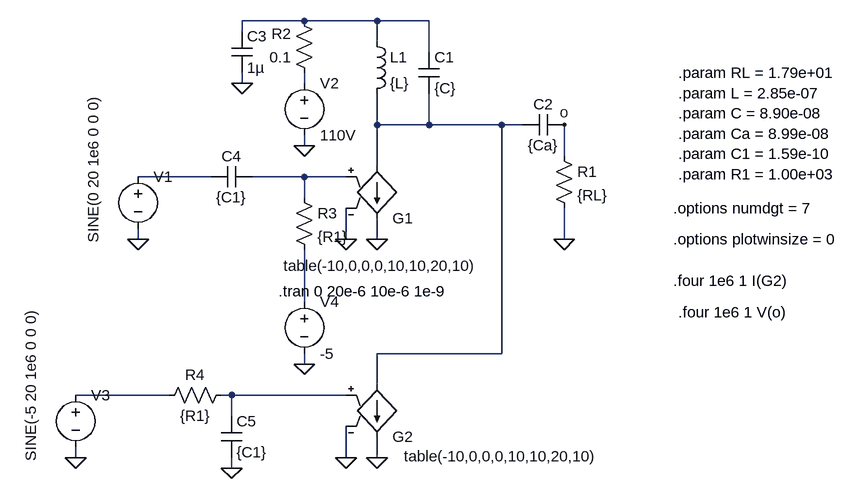
[diagram p0: schematic Parcial_20221128.asc]
Parcial_20221128.asc, the LTspice schematic file:
Version 4
SHEET 1 880 788
WIRE -288 -96 -384 -96
WIRE -176 -96 -288 -96
WIRE -96 -96 -176 -96
WIRE -384 -80 -384 -96
WIRE -176 -64 -176 -96
WIRE -96 -48 -96 -96
WIRE -384 0 -384 -16
WIRE -288 0 -288 -16
WIRE -176 64 -176 16
WIRE -96 64 -96 16
WIRE -96 64 -176 64
WIRE 16 64 -96 64
WIRE 48 64 16 64
WIRE -288 96 -288 80
WIRE 112 112 112 64
WIRE -176 128 -176 64
WIRE -432 144 -544 144
WIRE -288 144 -368 144
WIRE -224 144 -288 144
WIRE -288 176 -288 144
WIRE -544 240 -544 224
WIRE -224 240 -224 192
WIRE -176 240 -176 208
WIRE 112 240 112 192
WIRE -288 336 -288 256
WIRE 16 416 16 64
WIRE 16 416 -176 416
WIRE -288 432 -288 416
WIRE -176 464 -176 416
WIRE -496 480 -640 480
WIRE -400 480 -416 480
WIRE -224 480 -400 480
WIRE -400 512 -400 480
WIRE -640 576 -640 560
WIRE -224 576 -224 528
WIRE -176 576 -176 544
WIRE -400 592 -400 576
FLAG -176 240 0
FLAG 112 240 0
FLAG -224 240 0
FLAG -544 240 0
FLAG -288 96 0
FLAG 112 64 o
FLAG -384 0 0
FLAG -176 576 0
FLAG -224 576 0
FLAG -640 576 0
FLAG -288 432 0
FLAG -400 592 0
SYMBOL voltage -544 128 R0
WINDOW 3 -69 118 VLeft 2
WINDOW 123 0 0 Left 2
WINDOW 39 0 0 Left 2
SYMATTR Value SINE(0 20 1e6 0 0 0)
SYMATTR InstName V1
SYMBOL ind -192 -80 R0
SYMATTR InstName L1
SYMATTR Value {L}
SYMBOL cap -112 -48 R0
SYMATTR InstName C1
SYMATTR Value {C}
SYMBOL cap 112 48 R90
WINDOW 0 0 32 VBottom 2
WINDOW 3 32 32 VTop 2
SYMATTR InstName C2
SYMATTR Value {Ca}
SYMBOL voltage -288 -16 R0
WINDOW 123 0 0 Left 2
WINDOW 39 0 0 Left 2
SYMATTR InstName V2
SYMATTR Value 110V
SYMBOL res 96 96 R0
SYMATTR InstName R1
SYMATTR Value {RL}
SYMBOL g2 -176 224 M180
WINDOW 3 -144 -57 Left 2
SYMATTR Value table(-10,0,0,0,10,10,20,10)
SYMATTR InstName G1
SYMBOL cap -400 -80 R0
SYMATTR InstName C3
SYMATTR Value 1µ
SYMBOL res -272 0 R180
WINDOW 0 36 76 Left 2
WINDOW 3 36 40 Left 2
SYMATTR InstName R2
SYMATTR Value 0.1
SYMBOL voltage -640 464 R0
WINDOW 3 -69 118 VLeft 2
WINDOW 123 0 0 Left 2
WINDOW 39 0 0 Left 2
SYMATTR Value SINE(-5 20 1e6 0 0 0)
SYMATTR InstName V3
SYMBOL g2 -176 560 M180
WINDOW 3 41 -14 Left 2
SYMATTR Value table(-10,0,0,0,10,10,20,10)
SYMATTR InstName G2
SYMBOL cap -368 128 R90
WINDOW 0 0 32 VBottom 2
WINDOW 3 32 32 VTop 2
SYMATTR InstName C4
SYMATTR Value {C1}
SYMBOL res -304 160 R0
SYMATTR InstName R3
SYMATTR Value {R1}
SYMBOL cap -416 512 R0
SYMATTR InstName C5
SYMATTR Value {C1}
SYMBOL res -400 464 R90
WINDOW 0 0 56 VBottom 2
WINDOW 3 32 56 VTop 2
SYMATTR InstName R4
SYMATTR Value {R1}
SYMBOL voltage -288 320 R0
WINDOW 123 0 0 Left 0
WINDOW 39 0 0 Left 0
SYMATTR InstName V4
SYMATTR Value -5
TEXT -328 320 Left 2 !.tran 0 20e-6 10e-6 1e-9
TEXT 280 192 Left 2 !.options numdgt = 7
TEXT 280 240 Left 2 !.options plotwinsize = 0
TEXT 280 304 Left 2 !.four 1e6 1 I(G2)
TEXT 288 352 Left 2 !.four 1e6 1 V(o)
TEXT 288 -16 Left 2 !.param RL = 1.79e+01\n.param L = 2.85e-07\n.param C = 8.90e-08\n.param Ca = 8.99e-08\n.param C1 = 1.59e-10\n.param R1 = 1.00e+03

The netlist it stands for:
* Parcial_20221128.asc
V1 N004 0 SINE(0 20 1e6 0 0 0)
L1 N001 N003 {L}
C1 N001 N003 {C}
C2 o N003 {Ca}
V2 N002 0 110V
R1 o 0 {RL}
G1 N003 0 N005 0 table(-10,0,0,0,10,10,20,10)
C3 N001 0 1µ
R2 N002 N001 0.1
V3 N007 0 SINE(-5 20 1e6 0 0 0)
G2 N003 0 N008 0 table(-10,0,0,0,10,10,20,10)
C4 N005 N004 {C1}
R3 N005 N006 {R1}
C5 N008 0 {C1}
R4 N008 N007 {R1}
V4 N006 0 -5
.tran 0 20e-6 10e-6 1e-9
.options numdgt = 7
.options plotwinsize = 0
.four 1e6 1 I(G2)
.four 1e6 1 V(o)
.param RL = 1.79e+01
.param L = 2.85e-07
.param C = 8.90e-08
.param Ca = 8.99e-08
.param C1 = 1.59e-10
.param R1 = 1.00e+03
.backanno
.end